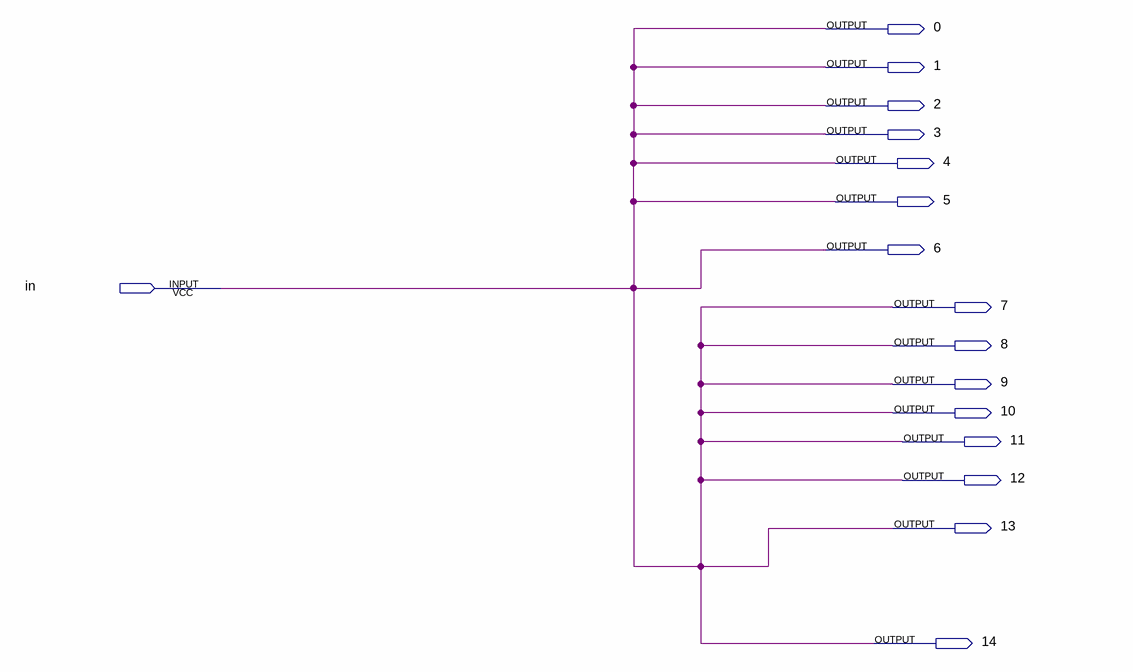
[diagram p0: schematic sheet]
// Quartus schematic 1_to_7_splitter.bdf as structural Verilog: 0 symbols, 16 pins
module \1_to_7_splitter  (
  input  in,
  output \0 ,
  output \1 ,
  output \2 ,
  output \3 ,
  output \4 ,
  output \5 ,
  output \6 ,
  output \7 ,
  output \8 ,
  output \9 ,
  output \10 ,
  output \11 ,
  output \12 ,
  output \13 ,
  output \14 
);


  assign \0  = in;
  assign \1  = in;
  assign \2  = in;
  assign \3  = in;
  assign \4  = in;
  assign \5  = in;
  assign \6  = in;
  assign \7  = in;
  assign \8  = in;
  assign \9  = in;
  assign \10  = in;
  assign \11  = in;
  assign \12  = in;
  assign \13  = in;
  assign \14  = in;
endmodule
